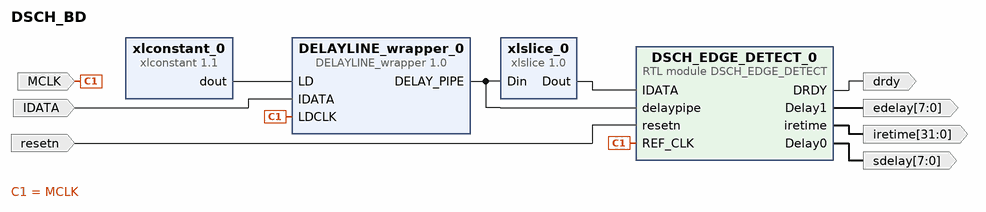
[diagram p0: block diagram of the top level]
# Vivado block design DSCH_BD, xc7z020clg400-1, Vivado 2019.1
create_bd_design DSCH_BD

create_bd_port -dir I IDATA
create_bd_port -dir I -type rst resetn
create_bd_port -dir I -type clk MCLK
set_property -dict {CONFIG.FREQ_HZ 460000000} [get_bd_ports MCLK]
create_bd_port -dir O -from 7 -to 0 -type data sdelay
create_bd_port -dir O -from 7 -to 0 -type data edelay
create_bd_port -dir O -from 31 -to 0 -type data iretime
create_bd_port -dir O -type data drdy

create_bd_cell -type ip -vlnv cri.nz:user:DELAYLINE_wrapper:1.0 DELAYLINE_wrapper_0
create_bd_cell -type module -reference DSCH_EDGE_DETECT DSCH_EDGE_DETECT_0
create_bd_cell -type ip -vlnv xilinx.com:ip:xlslice:1.0 xlslice_0
set_property -dict {CONFIG.DIN_FROM 0 CONFIG.DIN_TO 0 CONFIG.DIN_WIDTH 64} [get_bd_cells xlslice_0]
create_bd_cell -type ip -vlnv xilinx.com:ip:xlconstant:1.1 xlconstant_0

# ---- connections ----

connect_bd_net [get_bd_pins xlslice_0/Dout] [get_bd_pins DSCH_EDGE_DETECT_0/IDATA]
connect_bd_net [get_bd_pins DELAYLINE_wrapper_0/DELAY_PIPE] [get_bd_pins xlslice_0/Din] [get_bd_pins DSCH_EDGE_DETECT_0/delaypipe]
connect_bd_net [get_bd_ports IDATA] [get_bd_pins DELAYLINE_wrapper_0/IDATA]
connect_bd_net [get_bd_ports MCLK] [get_bd_pins DSCH_EDGE_DETECT_0/REF_CLK] [get_bd_pins DELAYLINE_wrapper_0/LDCLK]
connect_bd_net [get_bd_ports resetn] [get_bd_pins DSCH_EDGE_DETECT_0/resetn]
connect_bd_net [get_bd_pins xlconstant_0/dout] [get_bd_pins DELAYLINE_wrapper_0/LD]
connect_bd_net [get_bd_pins DSCH_EDGE_DETECT_0/Delay0] [get_bd_ports sdelay]
connect_bd_net [get_bd_pins DSCH_EDGE_DETECT_0/Delay1] [get_bd_ports edelay]
connect_bd_net [get_bd_pins DSCH_EDGE_DETECT_0/iretime] [get_bd_ports iretime]
connect_bd_net [get_bd_pins DSCH_EDGE_DETECT_0/DRDY] [get_bd_ports drdy]

validate_bd_design
save_bd_design
